# EAGLE design mbedquadstepperminimalNODIODE (EAGLE 5.10)
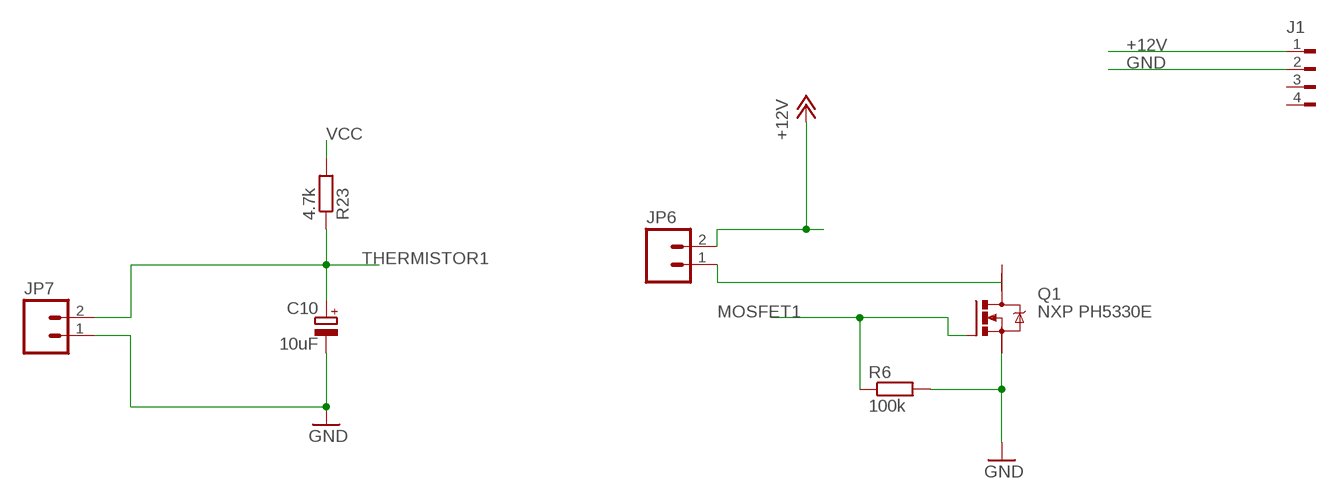
[diagram p0: schematic, sheet 1, part 1 of 2]
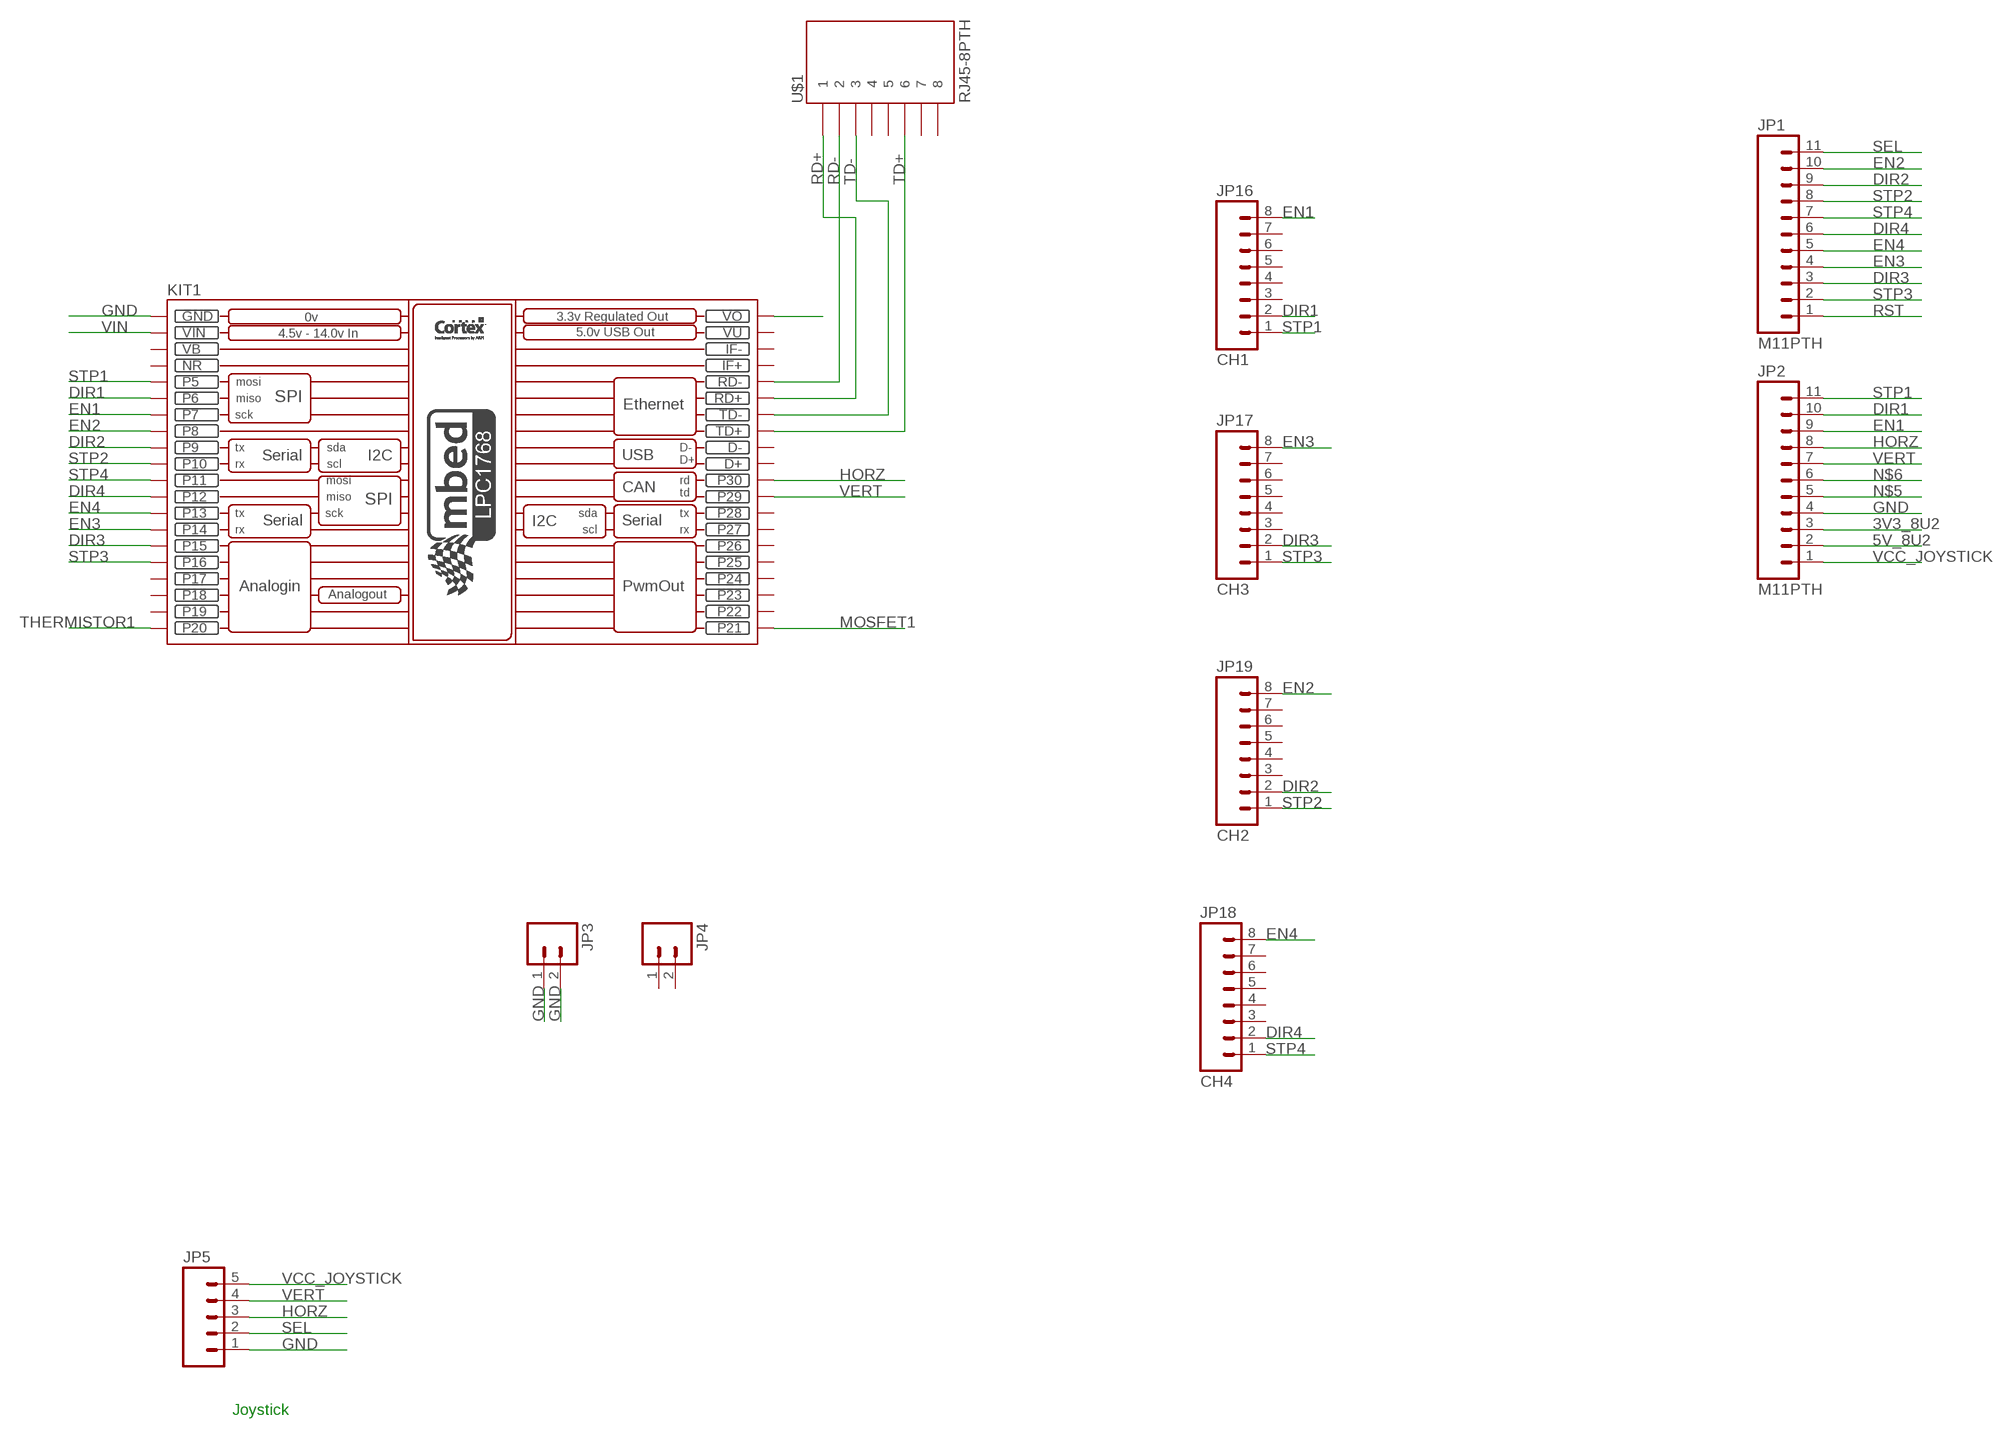
[diagram p1: schematic, sheet 1, part 2 of 2]

## Parts
C10  10uF  CPOL-EUTT5D7  [TT5D7]
J1  FLOPPY-4  [FLOPPY-4]
JP1  M11PTH  [1X11]
JP2  M11PTH  [1X11]
JP3  M02PTH  [1X02]
JP4  M02PTH  [1X02]
JP5  M05LOCK_LONGPADS  [1X05_LOCK_LONGPADS]
JP6  M02LOCK_LONGPADS  [1X02_LOCK_LONGPADS]
JP7  M02LOCK_LONGPADS  [1X02_LOCK_LONGPADS]
JP16  CH1  M08  [1X08]
JP17  CH3  M08  [1X08]
JP18  CH4  M08  [1X08]
JP19  CH2  M08  [1X08]
KIT1  MBED_NXP_LPC1768  [MBED-KIT]
Q1  NXP PH5330E  N-MOSFET-SO8S  [SO-08]
R6  100k  R-EU_R1206  [R1206]
R23  4.7k  R-EU_R1206  [R1206]
U$1  RJ45-8PTH  [RJ45-8]

## Nets
3V3_8U2: JP2.3
5V_8U2: JP2.2
+12V [highpower]: J1.1 JP6.2
DIR1: JP2.10 JP16.2 KIT1.P$6(P6)
DIR2: JP1.9 JP19.2 KIT1.P$9(P9)
DIR3: JP1.3 JP17.2 KIT1.P$15(P15)
DIR4: JP1.6 JP18.2 KIT1.P$12(P12)
EN1: JP2.9 JP16.8 KIT1.P$7(P7)
EN2: JP1.10 JP19.8 KIT1.P$8(P8)
EN3: JP1.4 JP17.8 KIT1.P$14(P14)
EN4: JP1.5 JP18.8 KIT1.P$13(P13)
GND: C10.- J1.2 JP2.4 JP3.1 JP3.2 JP5.1 JP7.1 KIT1.GND Q1.1(S) R6.2
HORZ: JP2.8 JP5.3 KIT1.P$30(P30)
MOSFET1: KIT1.P$21(P21) Q1.4(G) R6.1
N$5: JP2.5
N$6: JP2.6
N$7: JP6.1 Q1.7(D)
RD+: KIT1.RD+ U$1.1
RD-: KIT1.RD- U$1.2
RST: JP1.1
SEL: JP1.11 JP5.2
STP1: JP2.11 JP16.1 KIT1.P$5(P5)
STP2: JP1.8 JP19.1 KIT1.P$10(P10)
STP3: JP1.2 JP17.1 KIT1.P$16(P16)
STP4: JP1.7 JP18.1 KIT1.P$11(P11)
TD+: KIT1.TD+ U$1.6
TD-: KIT1.TD- U$1.3
THERMISTOR1: C10.+ JP7.2 KIT1.P$20(P20) R23.1
VCC: KIT1.VOUT(VO) R23.2
VCC_JOYSTICK: JP2.1 JP5.5
VERT: JP2.7 JP5.4 KIT1.P$29(P29)
VIN: KIT1.VIN
Unconnected: J1.3 J1.4 JP4.1 JP4.2 JP16.3 JP16.4 JP16.5 JP16.6 JP16.7 JP17.3 JP17.4 JP17.5 JP17.6 JP17.7 JP18.3 JP18.4 JP18.5 JP18.6 JP18.7 JP19.3 JP19.4 JP19.5 JP19.6 JP19.7 KIT1.D+ KIT1.D- KIT1.IF+ KIT1.IF- KIT1.P$17(P17) KIT1.P$18(P18) KIT1.P$19(P19) KIT1.P$22(P22) KIT1.P$23(P23) KIT1.P$24(P24) KIT1.P$25(P25) KIT1.P$26(P26) KIT1.P$27(P27) KIT1.P$28(P28) Q1.2(S) Q1.3(S) Q1.5(D) Q1.6(D) Q1.8(D) U$1.4 U$1.5 U$1.7 U$1.8

## Notes on the sheet
- Joystick

## Power pins joined to a net without a drawn wire
NR: KIT1.NR
VB: KIT1.VB
VU: KIT1.VU

## Library data of the parts
C10 = rcl:CPOL-EU: POLARIZED CAPACITOR, European symbol
J1 = con-amp:FLOPPY-4: MATE N-LOCK Floppy / HDD conector Distributor: Bürklin 71F970
JP1 JP2 = SparkFun:M11: Header 11 Standard 11-pin 0.1" header. Use with straight break away headers (SKU : PRT-00116), right angle break away headers (PRT-00553), swiss pins (PRT-00743), machine pins (PRT-00117), and female headers (PRT-00115).
JP3 JP4 JP6 JP7 = SparkFun:M02: Header 2 Standard 2-pin 0.1" header. Use with straight break away headers (SKU : PRT-00116), right angle break away headers (PRT-00553), swiss pins (PRT-00743), machine pins (PRT-00117), and female headers (PRT-00115). Molex polarized connector foot print use with SKU : PRT-08233 with associated crimp pins and housings.
JP5 = SparkFun:M05: Header 5 Standard 5-pin 0.1" header. Use with straight break away headers (SKU : PRT-00116), right angle break away headers (PRT-00553), swiss pins (PRT-00743), machine pins (PRT-00117), and female headers (PRT-00115). Molex polarized connector foot print use with SKU : PRT-08230 with associated crimp pins and housings.
JP16-JP19 = SparkFun:M08: Header 8 Standard 8-pin 0.1" header. Use with straight break away headers (SKU : PRT-00116), right angle break away headers (PRT-00553), swiss pins (PRT-00743), machine pins (PRT-00117), and female headers (PRT-00115).
KIT1 = MBED_v2.1:MBED_NXP_LPC1768: Mbed LPC1768 - ARM CORTEX v2.1 * Schematic symbol is now placed in eagles's default raster. *The pads diameter are suitable for routing between mbed pins * mbed pads are 0.8 mm drill diameter. --------------------------------------------- Created by: Mohamed Yousry *Alexandria, Egypt *Email: mohamed.yousry@ieeegoldegypt.org
Q1 = transistor-power:N-MOSFET-SO8: N-Channel MOSFET Example: FDS7760A; N-Channel Logic Level PowerTrench® MOSFET FDS2572; N-Channel UltraFET® Trench MOSFET Source: www.fairchildsemi.com
R6 R23 = rcl:R-EU_: RESISTOR, European symbol
U$1 = SparkFun:RJ45-8: RJ45 Jack Simple RJ45, 8-pin connection - connector for common Cat5, Cat5e, and Cat6 Ethernet cables. Footprint not yet proven in production. Connector sku is PRT-00643; Breakout PCB sku is BOB-00716.

## Net classes
0 default: width 0.6 mm, drill 0.6 mm, clearance 0.1 mm
1 highpower: width 1 mm, drill 0.6 mm, clearance 0.1 mm

## Board
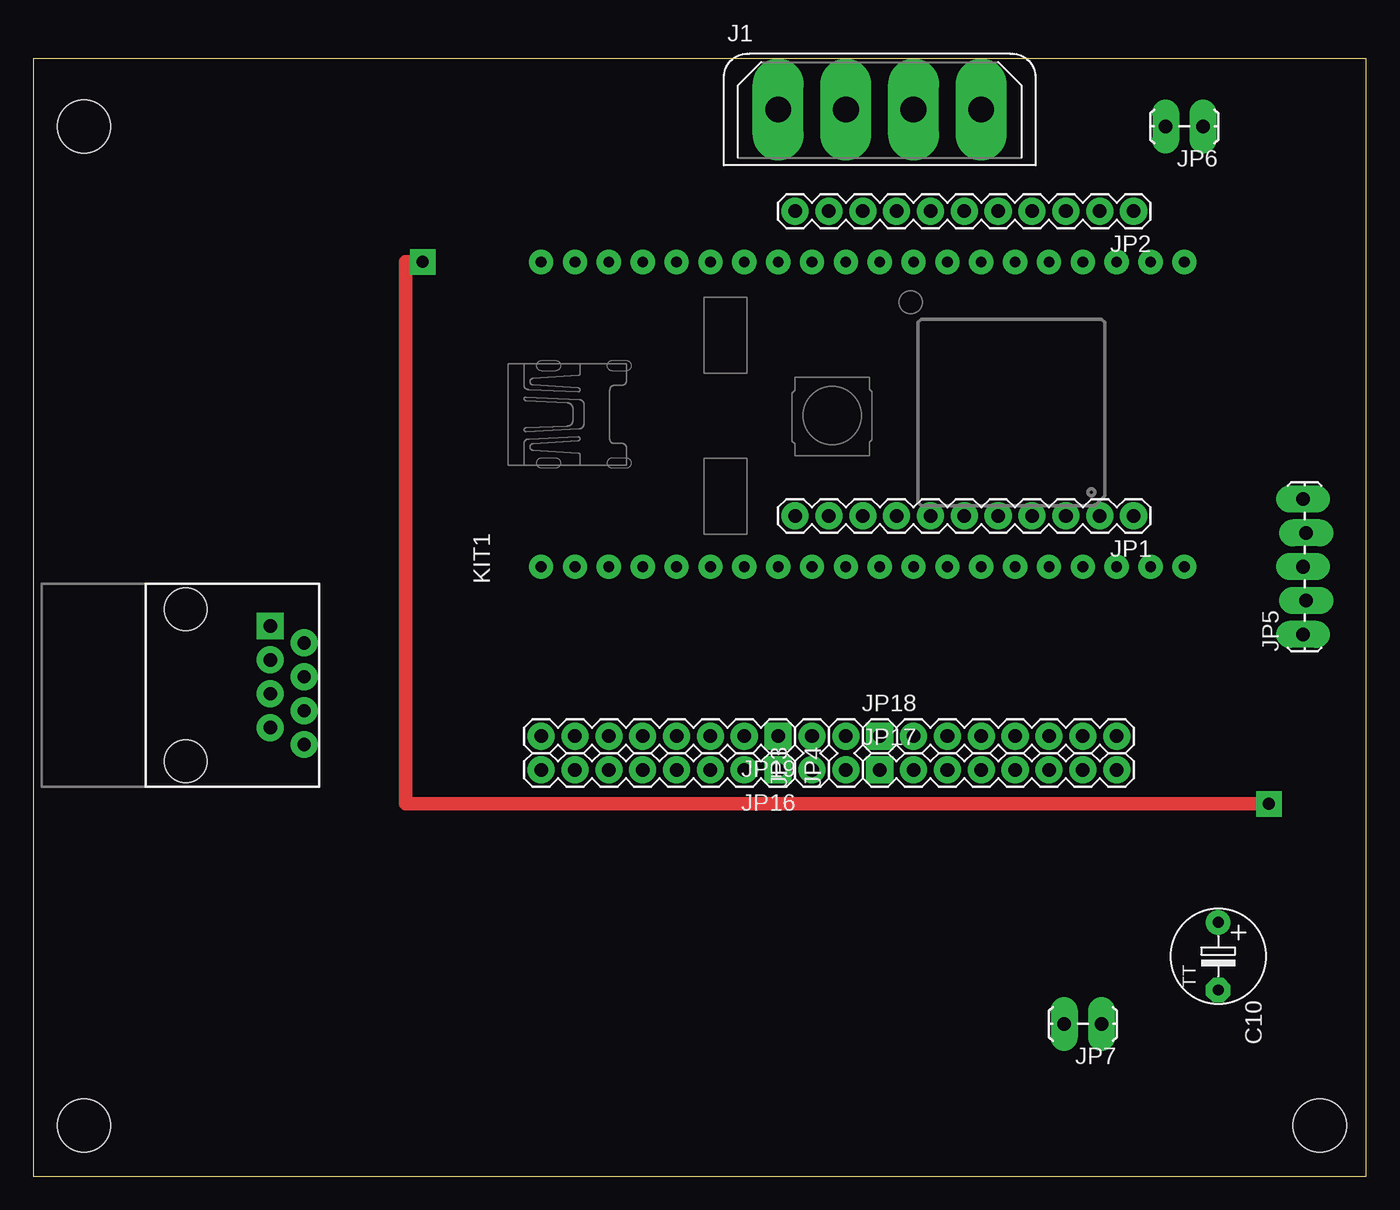
[diagram p2: board, top side]
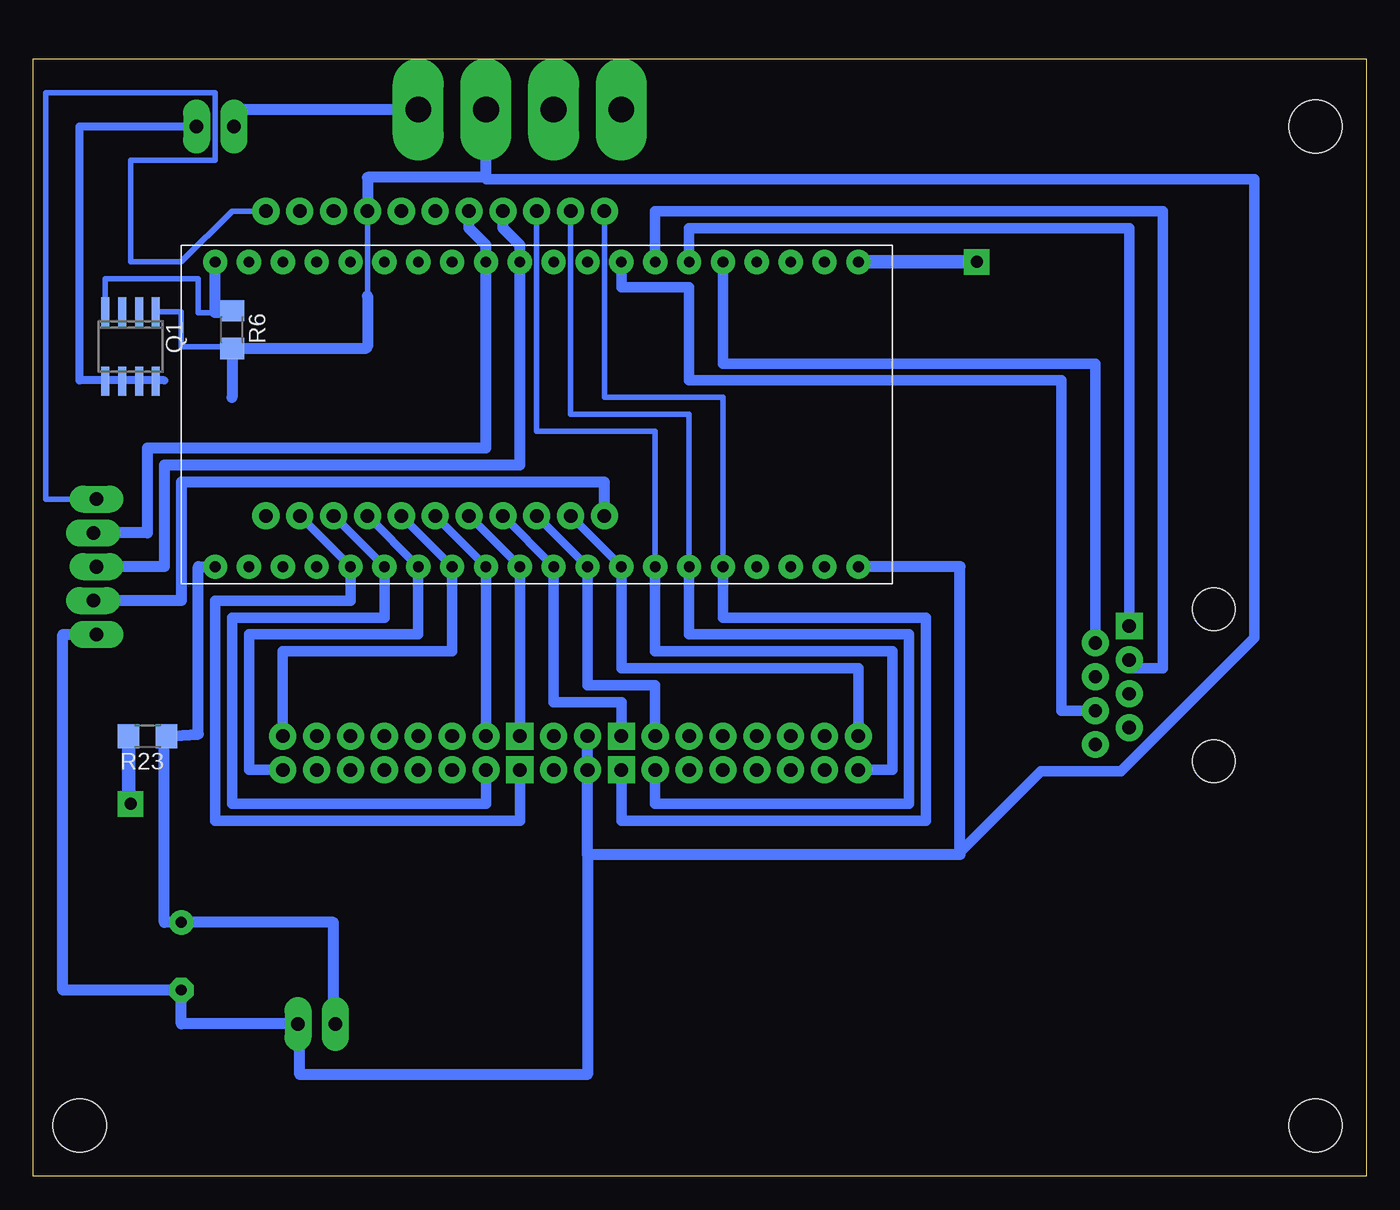
[diagram p3: board, bottom side, seen from below]

Size 100 x 83.81 mm. Coordinates in mm from the lower left corner, seen from the top.
Outline: 0,0 100,0 100,83.81 0,83.81 0,0
Copper layers (1*16): Top 0.035mm / dielectric 1.5mm / Bottom 0.035mm
Design rules "default *": minimum track width 0.8mm, minimum drill 0.8mm, track to track 8mil, track to pad 8mil, pad to pad 8mil, via to via 8mil, smd to smd 8mil, copper to edge 40mil, drill to drill 8mil, minimum pad ring 20mil, minimum via ring 20mil, stop-mask expansion 4mil, vias tented up to drill 0mil, thermal gap 10mil
Holes 4 mm at 3.81,3.81 3.81,78.74 96.52,3.81
tRestrict: area 1.3,29.2 to 21.6,44.4
vRestrict: area 35.6,44.4 to 88.9,69.8

### Footprints (pad centres in the part's own frame; a part is rotated, then mirrored left to right if it is on the bottom)
TT5D7 = drill 0.813 round: + -2.54,0 | drill 0.813 octagon: - 2.54,0
FLOPPY-4 = drill 1.93 pad 3.81 long: 1 7.62,0; 2 2.54,0; 3 -2.54,0; 4 -7.62,0
1X11 = drill 1.016 pad 1.88 round: 1 0,0; 2 2.54,0; 3 5.08,0; 4 7.62,0; 5 10.16,0; 6 12.7,0; 7 15.24,0; 8 17.78,0; 9 20.32,0; 10 22.86,0; 11 25.4,0
1X02 = drill 1.016 pad 1.88 round: 1 0,0; 2 2.54,0
1X05_LOCK_LONGPADS = drill 1.016 long: 1 0,0; 2 2.54,-0.254; 3 5.08,0; 4 7.62,-0.254; 5 10.16,0
1X02_LOCK_LONGPADS = drill 1.016 long: 1 -0.127,0; 2 2.667,0
1X08 = drill 1.016 pad 1.88 square: 1 0,0 | drill 1.016 pad 1.88 round: 2 2.54,0; 3 5.08,0; 4 7.62,0; 5 10.16,0; 6 12.7,0; 7 15.24,0; 8 17.78,0
MBED-KIT = drill 0.8 round: D+ 11.43,1.27; D- 11.43,3.81; GND -11.43,24.13; IF+ 11.43,16.51; IF- 11.43,19.05; NR -11.43,16.51; P$5 -11.43,13.97; P$6 -11.43,11.43; P$7 -11.43,8.89; P$8 -11.43,6.35; P$9 -11.43,3.81; P$10 -11.43,1.27; P$11 -11.43,-1.27; P$12 -11.43,-3.81; P$13 -11.43,-6.35; P$14 -11.43,-8.89; P$15 -11.43,-11.43; P$16 -11.43,-13.97; P$17 -11.43,-16.51; P$18 -11.43,-19.05; P$19 -11.43,-21.59; P$20 -11.43,-24.13; P$21 11.43,-24.13; P$22 11.43,-21.59; P$23 11.43,-19.05; P$24 11.43,-16.51; P$25 11.43,-13.97; P$26 11.43,-11.43; P$27 11.43,-8.89; P$28 11.43,-6.35; P$29 11.43,-3.81; P$30 11.43,-1.27; RD+ 11.43,11.43; RD- 11.43,13.97; TD+ 11.43,6.35; TD- 11.43,8.89; VB -11.43,19.05; VIN -11.43,21.59; VOUT 11.43,24.13; VU 11.43,21.59
SO-08 = smd 0.6 x 2.2: 1 -1.905,-2.6; 2 -0.635,-2.6; 3 0.635,-2.6; 4 1.905,-2.6; 5 1.905,2.6; 6 0.635,2.6; 7 -0.635,2.6; 8 -1.905,2.6
R1206 = smd 1.6 x 1.803: 1 -1.422,0; 2 1.422,0
RJ45-8 = drill 1 pad 1.88 square: 1 -4.445,6.35 | drill 1 pad 1.88 round: 2 -3.175,8.89; 3 -1.905,6.35; 4 -0.635,8.89; 5 0.635,6.35; 6 1.905,8.89; 7 3.175,6.35; 8 4.445,8.89 | hole 3.2: -5.715,0; 5.715,0

### Placement (x,y rotation side)
C10  88.9,16.51 270 top
J1  63.5,80.01 0 top
JP1  82.55,49.53 180 top
JP2  82.55,72.39 180 top
JP3  58.42,30.48 90 top
JP4  60.96,30.48 90 top
JP5  95.25,40.64 90 top
JP6  87.63,78.74 180 top
JP7  80.01,11.43 180 top
JP16  55.88,30.48 180 top
JP17  63.5,30.48 0 top
JP18  63.5,33.02 0 top
JP19  55.88,33.02 180 top
KIT1  62.23,57.15 90 top
Q1  92.71,62.23 180 bottom
R6  85.09,63.5 270 bottom
R23  91.44,33.02 180 bottom
U$1  11.43,36.83 270 top

### Tracks (layer width: path | path; a pad name or v marks a point on that pad's centre or on a via)
+12V
  Bottom 0.813: J1.1 84.96,80.01 JP6.2
DIR1
  Bottom 0.406: JP2.10 59.69,57.15 50.8,57.15 KIT1.P$6
  Bottom 0.8: JP16.2 53.34,27.94 34.29,27.94 34.29,40.64 50.8,40.64 KIT1.P$6
DIR2
  Bottom 0.61: KIT1.P$9 JP1.9
  Bottom 0.8: JP19.2 53.34,36.83 58.42,36.83 KIT1.P$9
DIR3
  Bottom 0.61: KIT1.P$15 JP1.3
  Bottom 0.8: JP17.2 66.04,27.94 85.09,27.94 85.09,41.91 73.66,41.91 KIT1.P$15
DIR4
  Bottom 0.61: KIT1.P$12 JP1.6
  Bottom 0.8: JP18.2 KIT1.P$12
EN1
  Bottom 0.406: JP2.9 62.23,55.88 53.34,55.88 KIT1.P$7
  Bottom 0.8: JP16.8 35.56,30.48 35.56,39.37 53.34,39.37 KIT1.P$7
EN2
  Bottom 0.61: KIT1.P$8 JP1.10
  Bottom 0.8: JP19.8 38.1,38.1 55.88,38.1 KIT1.P$8
EN3
  Bottom 0.61: KIT1.P$14 JP1.4
  Bottom 0.8: JP17.8 83.82,30.48 83.82,40.64 71.12,40.64 KIT1.P$14
EN4
  Bottom 0.61: KIT1.P$13 JP1.5
  Bottom 0.8: JP18.8 81.28,39.37 68.58,39.37 KIT1.P$13
GND
  Bottom 0.406: JP2.4 74.93,66.04 | Q1.1 88.9,64.83 88.9,62.23 85.09,62.23 R6.2
  Bottom 0.8: JP3.1 58.4,30.4 58.42,30.4 | 30.48,24.13 30.4,24.4 24.4,30.4 18.4,30.4 8.4,40.4 8.4,74.8 66,74.8 66.04,74.93
  Bottom 0.813: 85.09,58.42 R6.2 75.08,62.08 74.93,62.23 74.93,66.04 | J1.2 66.04,74.93 74.93,74.93 JP2.4 | JP5.1 97.79,40.64 97.79,13.97 C10.- 88.9,11.43 JP7.1 80.01,11.43 80.01,7.62 58.42,7.62 58.42,24.13 | 58.42,24.13 58.42,30.4 JP3.1 JP3.2 | KIT1.GND 30.48,45.72 30.48,24.13 58.42,24.13
HORZ
  Bottom 0.813: JP2.8 64.77,71.12 63.5,69.85 KIT1.P$30 63.5,53.34 90.17,53.34 90.17,45.72 JP5.3
MOSFET1
  Bottom 0.406: 85.09,64.77 87.63,64.77 87.63,67.31 94.61,67.31 Q1.4
  Bottom 0.813: R6.1 85.09,64.77 86.36,64.77 KIT1.P$21
N$7
  Bottom 0.61: JP6.1 96.52,78.74 96.52,59.69 92.08,59.69 | 90.17,59.69 92.08,59.69 | 92.08,59.69 Q1.7
RD+
  Bottom 0.8: KIT1.RD+ 50.8,71.12 17.78,71.12 U$1.1
RD-
  Bottom 0.8: KIT1.RD- 48.26,60.96 20.32,60.96 U$1.2
SEL
  Bottom 0.813: JP5.2 88.9,43.18 88.9,52.07 57.15,52.07 JP1.11
STP1
  Bottom 0.406: JP2.11 57.15,58.42 48.26,58.42 KIT1.P$5
  Bottom 0.8: JP16.1 55.88,26.67 33.02,26.67 33.02,41.91 48.26,41.91 KIT1.P$5
STP2
  Bottom 0.61: KIT1.P$10 JP1.8
  Bottom 0.8: JP19.1 55.88,35.56 60.96,35.56 KIT1.P$10
STP3
  Bottom 0.61: KIT1.P$16 JP1.2
  Bottom 0.8: JP17.1 63.5,26.67 86.36,26.67 86.36,43.18 76.2,43.18 KIT1.P$16
STP4
  Bottom 0.61: KIT1.P$11 JP1.7
  Bottom 0.8: JP18.1 KIT1.P$11
TD+
  Bottom 0.8: U$1.6 22.86,34.92 22.86,59.69 50.8,59.69 50.8,66.67 55.88,66.67 KIT1.TD+
TD-
  Bottom 0.8: KIT1.TD- 53.34,72.39 15.24,72.39 15.24,38.1 17.78,38.1 U$1.3
THERMISTOR1
  Bottom 0.813: JP7.2 77.47,11.43 77.47,19.05 C10.+ 90.17,19.05 90.17,33.02 R23.1 87.63,33.17 87.63,45.72 KIT1.P$20
VCC  (via drill 0.9)
  Top 1.016: v92.71,27.94 27.94,27.94 27.94,68.58 v29.21,68.58
  Bottom 1.016: v29.21,68.58 KIT1.VOUT | R23.2 92.86,28.09 v92.71,27.94
VCC_JOYSTICK
  Bottom 0.406: JP5.5 99.06,50.8 99.06,81.28 86.36,81.28 86.36,76.2 92.71,76.2 92.71,68.58 88.9,68.58 85.09,72.39 JP2.1
VERT
  Bottom 0.813: JP2.7 67.31,71.12 66.04,69.85 KIT1.P$29 66.04,54.61 91.44,54.61 91.44,48.26 JP5.4